# EAGLE schematic 9x9 LED Matrix (EAGLE 6.3)
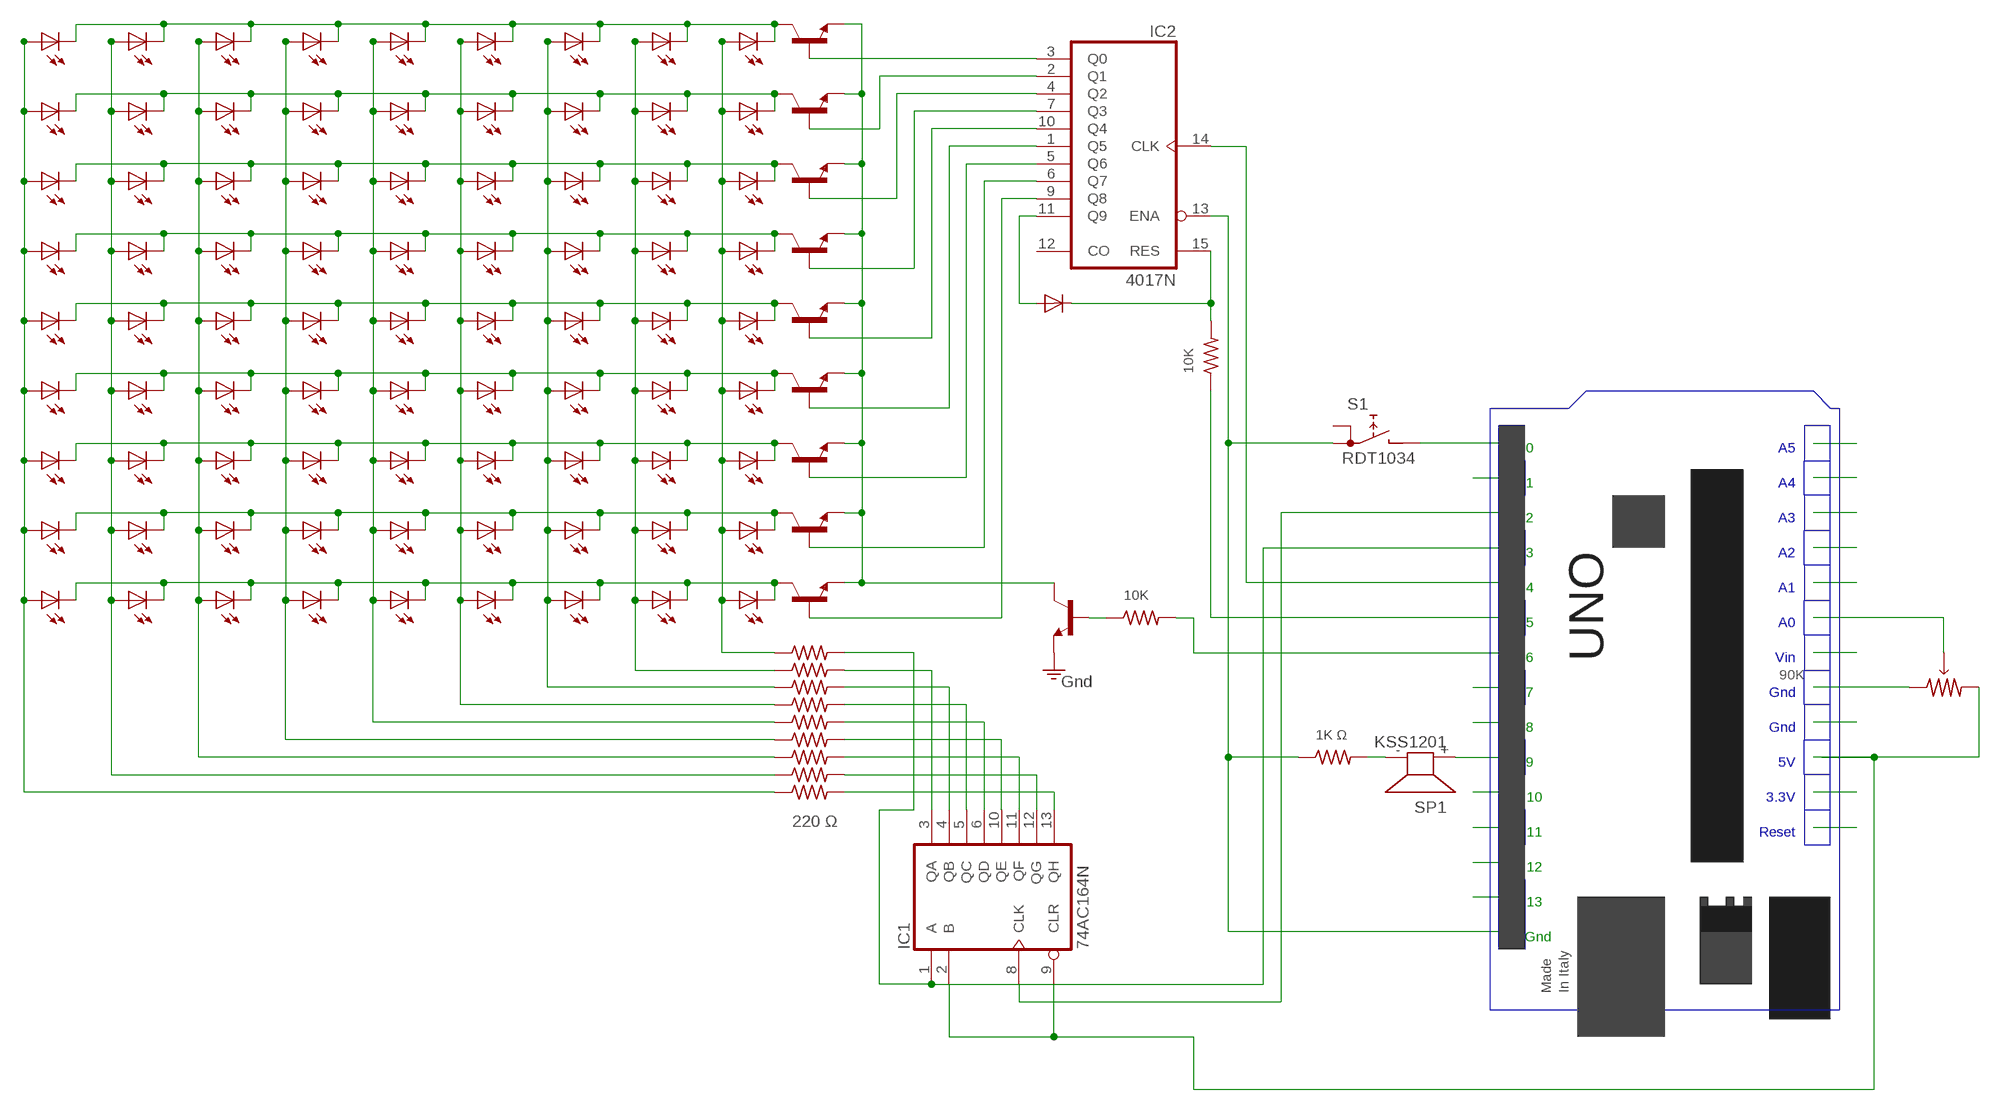
[diagram p0: schematic, sheet 1]

## Parts
D1  1N4004  [DO41-10]
IC1  74AC164N  [DIL14]
IC2  4017N  [DIL16]
LED1  TLLY4400  [LED3MM]
LED2  TLLY4400  [LED3MM]
LED3  TLLY4400  [LED3MM]
LED4  TLLY4400  [LED3MM]
LED5  TLLY4400  [LED3MM]
LED6  TLLY4400  [LED3MM]
LED7  TLLY4400  [LED3MM]
LED8  TLLY4400  [LED3MM]
LED9  TLLY4400  [LED3MM]
LED10  TLLY4400  [LED3MM]
LED11  TLLY4400  [LED3MM]
LED12  TLLY4400  [LED3MM]
LED13  TLLY4400  [LED3MM]
LED14  TLLY4400  [LED3MM]
LED15  TLLY4400  [LED3MM]
LED16  TLLY4400  [LED3MM]
LED17  TLLY4400  [LED3MM]
LED18  TLLY4400  [LED3MM]
LED19  TLLY4400  [LED3MM]
LED20  TLLY4400  [LED3MM]
LED21  TLLY4400  [LED3MM]
LED22  TLLY4400  [LED3MM]
LED23  TLLY4400  [LED3MM]
LED24  TLLY4400  [LED3MM]
LED25  TLLY4400  [LED3MM]
LED26  TLLY4400  [LED3MM]
LED27  TLLY4400  [LED3MM]
LED28  TLLY4400  [LED3MM]
LED29  TLLY4400  [LED3MM]
LED30  TLLY4400  [LED3MM]
LED31  TLLY4400  [LED3MM]
LED32  TLLY4400  [LED3MM]
LED33  TLLY4400  [LED3MM]
LED34  TLLY4400  [LED3MM]
LED35  TLLY4400  [LED3MM]
LED36  TLLY4400  [LED3MM]
LED37  TLLY4400  [LED3MM]
LED38  TLLY4400  [LED3MM]
LED39  TLLY4400  [LED3MM]
LED40  TLLY4400  [LED3MM]
LED41  TLLY4400  [LED3MM]
LED42  TLLY4400  [LED3MM]
LED43  TLLY4400  [LED3MM]
LED44  TLLY4400  [LED3MM]
LED45  TLLY4400  [LED3MM]
LED46  TLLY4400  [LED3MM]
LED47  TLLY4400  [LED3MM]
LED48  TLLY4400  [LED3MM]
LED49  TLLY4400  [LED3MM]
LED50  TLLY4400  [LED3MM]
LED51  TLLY4400  [LED3MM]
LED52  TLLY4400  [LED3MM]
LED53  TLLY4400  [LED3MM]
LED54  TLLY4400  [LED3MM]
LED55  TLLY4400  [LED3MM]
LED56  TLLY4400  [LED3MM]
LED57  TLLY4400  [LED3MM]
LED58  TLLY4400  [LED3MM]
LED59  TLLY4400  [LED3MM]
LED60  TLLY4400  [LED3MM]
LED61  TLLY4400  [LED3MM]
LED62  TLLY4400  [LED3MM]
LED63  TLLY4400  [LED3MM]
LED64  TLLY4400  [LED3MM]
LED65  TLLY4400  [LED3MM]
LED66  TLLY4400  [LED3MM]
LED67  TLLY4400  [LED3MM]
LED68  TLLY4400  [LED3MM]
LED69  TLLY4400  [LED3MM]
LED70  TLLY4400  [LED3MM]
LED71  TLLY4400  [LED3MM]
LED72  TLLY4400  [LED3MM]
LED73  TLLY4400  [LED3MM]
LED74  TLLY4400  [LED3MM]
LED75  TLLY4400  [LED3MM]
LED76  TLLY4400  [LED3MM]
LED77  TLLY4400  [LED3MM]
LED78  TLLY4400  [LED3MM]
LED79  TLLY4400  [LED3MM]
LED80  TLLY4400  [LED3MM]
LED81  TLLY4400  [LED3MM]
P1  10K  POT  [POT]
R1  R-US_0204/7  [0204/7]
R2  R-US_0204/7  [0204/7]
R3  R-US_0204/7  [0204/7]
S1  RDT1034  [RDT1034]
SP1  KSS1201  [KSS1201]
T1  2SC1740  [TO92-ECB]
T2  2SC1740  [TO92-ECB]
T3  2SC1740  [TO92-ECB]
T4  2SC1740  [TO92-ECB]
T5  2SC1740  [TO92-ECB]
T6  2SC1740  [TO92-ECB]
T7  2SC1740  [TO92-ECB]
T8  2SC1740  [TO92-ECB]
T9  2SC1740  [TO92-ECB]
T10  2SC1740  [TO92-ECB]
U$1  GND  [GND]
 2  R-US_0204/7  [0204/7]
 3  R-US_0204/7  [0204/7]
 4  R-US_0204/7  [0204/7]
 5  R-US_0204/7  [0204/7]
 6  R-US_0204/7  [0204/7]
 7  R-US_0204/7  [0204/7]
 8  R-US_0204/7  [0204/7]
 9  R-US_0204/7  [0204/7]
 10  R-US_0204/7  [0204/7]

## Nets
N$1: LED3.A LED4.A  9.1
N$2: LED1.A LED2.A  10.1
N$3: LED1.K(C) LED3.K(C)
N$4: LED2.K(C) LED4.K(C)
N$5: LED7.A LED8.A
N$6: LED5.A LED6.A
N$7: LED5.K(C) LED7.K(C)
N$8: LED6.K(C) LED8.K(C)
N$9: LED11.A LED12.A
N$10: LED9.A LED10.A
N$11: LED9.K(C) LED11.K(C)
N$12: LED10.K(C) LED12.K(C)
N$13: LED15.A LED16.A
N$14: LED13.A LED14.A
N$15: LED13.K(C) LED15.K(C)
N$16: LED14.K(C) LED16.K(C)
N$17: LED19.A LED20.A  7.1
N$18: LED17.A LED18.A  8.1
N$19: LED17.K(C) LED19.K(C)
N$20: LED18.K(C) LED20.K(C)
N$21: LED23.A LED24.A
N$22: LED21.A LED22.A
N$23: LED21.K(C) LED23.K(C)
N$24: LED22.K(C) LED24.K(C)
N$25: LED27.A LED28.A
N$26: LED25.A LED26.A
N$27: LED25.K(C) LED27.K(C)
N$28: LED26.K(C) LED28.K(C)
N$29: LED31.A LED32.A
N$30: LED29.A LED30.A
N$31: LED29.K(C) LED31.K(C)
N$32: LED30.K(C) LED32.K(C)
N$33: LED35.A LED36.A  5.1
N$34: LED33.A LED34.A  6.1
N$35: LED33.K(C) LED35.K(C)
N$36: LED34.K(C) LED36.K(C)
N$37: LED39.A LED40.A
N$38: LED37.A LED38.A
N$39: LED37.K(C) LED39.K(C)
N$40: LED38.K(C) LED40.K(C)
N$41: LED43.A LED44.A
N$42: LED41.A LED42.A
N$43: LED41.K(C) LED43.K(C)
N$44: LED42.K(C) LED44.K(C)
N$45: LED47.A LED48.A
N$46: LED45.A LED46.A
N$47: LED45.K(C) LED47.K(C)
N$48: LED46.K(C) LED48.K(C)
N$49: LED51.A LED52.A  3.1
N$50: LED49.A LED50.A  4.1
N$51: LED49.K(C) LED51.K(C)
N$52: LED50.K(C) LED52.K(C)
N$53: LED55.A LED56.A
N$54: LED53.A LED54.A
N$55: LED53.K(C) LED55.K(C)
N$56: LED54.K(C) LED56.K(C)
N$57: LED59.A LED60.A
N$58: LED57.A LED58.A
N$59: LED57.K(C) LED59.K(C)
N$60: LED58.K(C) LED60.K(C)
N$61: LED63.A LED64.A
N$62: LED61.A LED62.A
N$63: LED61.K(C) LED63.K(C)
N$64: LED62.K(C) LED64.K(C)
N$65: LED66.A
N$66: LED65.A
N$67: LED65.K(C) LED66.K(C)
N$68: LED68.A
N$69: LED67.A
N$70: LED67.K(C) LED68.K(C)
N$71: LED70.A
N$72: LED69.A
N$73: LED69.K(C) LED70.K(C)
N$74: LED72.A
N$75: LED71.A
N$76: LED71.K(C) LED72.K(C)
N$77: IC1.1(A)  2.2
N$78: LED73.K(C) T1.C
N$79: LED74.K(C) T2.C
N$80: LED75.A LED76.A
N$81: LED75.K(C) T3.C
N$82: LED76.K(C) T4.C
N$83: LED77.A LED78.A
N$84: LED77.K(C) T5.C
N$85: LED78.K(C) T6.C
N$86: LED79.A LED80.A
N$87: LED79.K(C) T7.C
N$88: LED80.K(C) T8.C
N$89: LED81.A
N$90: LED81.K(C) T9.C
N$91: IC2.3(Q0) T9.B
N$92: IC2.2(Q1) T8.B
N$93: IC2.4(Q2) T7.B
N$94: IC2.7(Q3) T6.B
N$95: IC2.10(Q4) T5.B
N$96: IC2.1(Q5) T4.B
N$97: IC2.5(Q6) T3.B
N$98: IC2.6(Q7) T2.B
N$99: IC2.9(Q8) T1.B
N$100: D1.A IC2.11(Q9)
N$101: T1.E T2.E T3.E T4.E T5.E T6.E T7.E T8.E T9.E T10.C
N$102: T10.E U$1.P$1
N$103: IC2.13(ENA) R3.1 S1.A1
N$107: P1.0
N$108: R2.2
N$111: R1.1
N$112: IC1.8(CLK) IC2.14(CLK) S1.B
N$113: SP1.+
N$115: R3.2 SP1.-
N$120: P1.1
N$126: D1.C IC2.15(RES) R1.2
N$127: R2.1 T10.B
N$128: LED73.A LED74.A  2.1
N$129: IC1.3(QA)  3.2
N$130: IC1.2(B) IC1.9(CLR) P1.2
N$131: IC1.4(QB)  4.2
N$132: IC1.5(QC)  5.2
N$133: IC1.6(QD)  6.2
N$134: IC1.10(QE)  7.2
N$135: IC1.11(QF)  8.2
N$136: IC1.12(QG)  9.2
N$137: IC1.13(QH)  10.2
Unconnected: IC2.12(CO) S1.A

## Buses
B$1
B$2
B$3

## Notes on the sheet
- 10K
- 0 | A5
- 1 | A4
- 2 | A3
- 3 | A2
- 4 | A1
- 10K
- 5 | A0
- 6 | Vin
- UNO
- 90K
- 7 | Gnd
- 8 | Gnd
- 1K Ω
- 9 | 5V
- 10 | 3.3V
- 220 Ω | 11 | Reset
- 12
- 13
- Gnd
- Made | In Italy

## Power pins joined to a net without a drawn wire
GND: IC1.7(GND)
VCC: IC1.14(VCC)
VDD: IC2.16(VDD)
VSS: IC2.8(VSS)

## Library data of the parts
D1 = diode:1N4004: DIODE general purpose rectifier, 1 A
IC1 = 74xx-eu:74*164: 8-bit parallel out SHIFT REGISTER
IC2 = 40xx:4017: COUNTER/DIVIDER
LED1-LED81 = led:TLLY4400: Low Current (2mA) LED 3 mm Tinted Diffused Package color YELLOW Source: Data sheet <http://www.farnell.com/datasheets/391098.pdf>; MF: VISHAY SEMICONDUCTOR; OC_FARNELL: 1612439
P1 = 001 Custom Lib.:POT: American Potentiometer schematic symbol; RESISTANCE: value here
R1-R3 = rcl:R-US_: RESISTOR, American symbol
S1 = switch:RDT1034: PUSH SWITCH www.radiohm.com
SP1 = buzzer:KSS1201: SPEAKER Source: Schukat; OC_FARNELL: unknown; OC_NEWARK: unknown
T1-T10 = transistor:2SC1740: NPN Silicon Epitaxial Planar Transistor Source: SEMTECH ELECTRONICS LTD. 2SC1740.pdf
U$1 = 001 Custom Lib.:GND: the Ground, Gnd,American symbol
 2- 10 = resistor:R-US_: RESISTOR, American symbol